# EasyEDA Pro project ProPrj_WLED ESP32 d1 mini shield_2025-11-08.epro

# Schematic Schematic1
Board Name: Board1; Create Date: 2025-10-29; Page Name: P1; Project Name: WLED ESP32 d1 mini shield; Schematic Name: Schematic1; Update Date: 2025-10-31; Company: EasyEDA.com; Page Size: A4; Version: V1.0
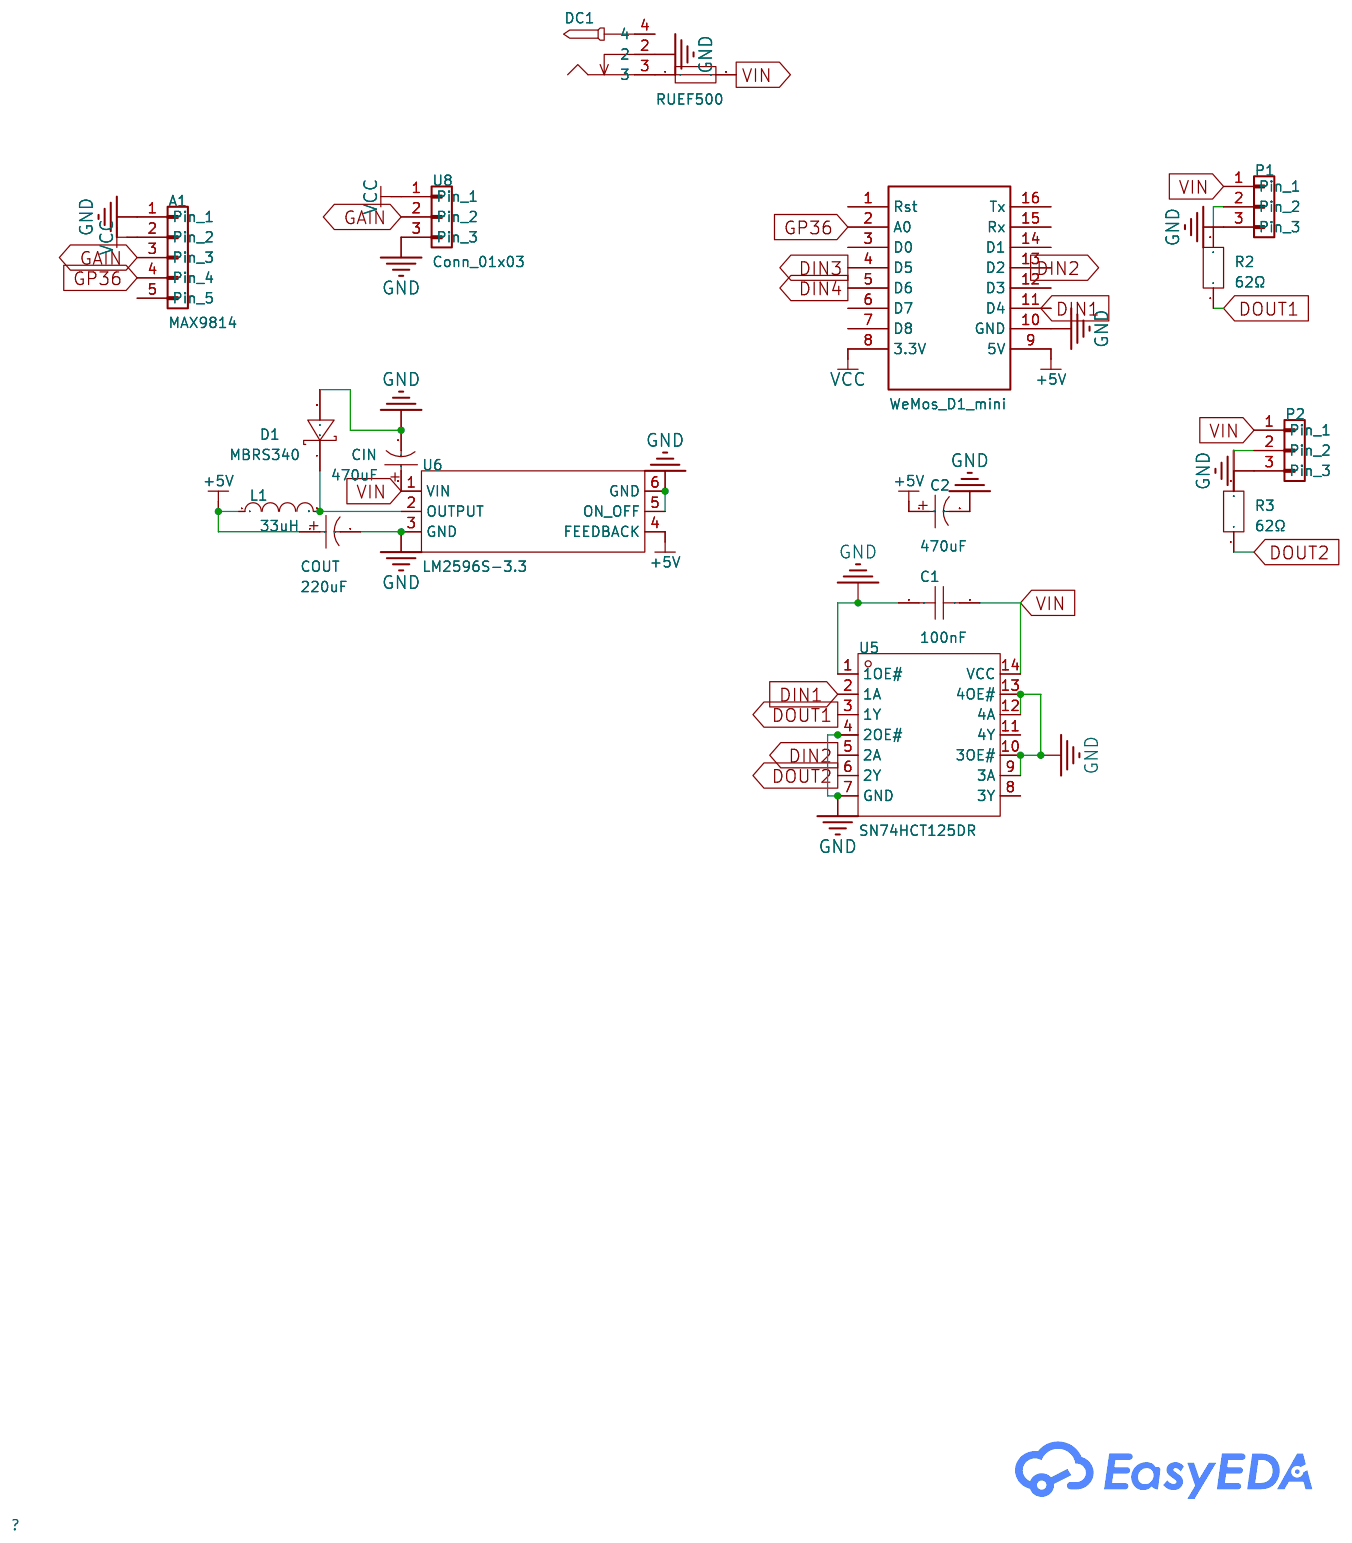
[diagram p0: schematic sheet]

## Parts
A1  MAX9814  [CONN-TH-5P_A2543WV-5P]
C1  100nF  [CAP-TH_L5.8-W2.8]
C2  470uF  [CAP-TH_BD8.0-P3.50-D0.6-FD]
CIN  470uF  [CAP-SMD_L7.3-W4.3_H2.8]
COUT  220uF  [CAP-SMD_L7.3-W4.3_H2.8]
D1  MBRS340  [SMC_L6.9-W5.9-LS7.9-RD]
DC1  DC-005 2.0  [DC-IN-TH_DC-005-5.5-2.0]
F1  RUEF500  [FUSE-TH_L14.0-W3.0-P10.20-D1.2-S1.2]
L1  10uH  [CONN-TH_2P-P2.50_691347000002B]
P1  Conn_01x03  [CONN-TH_3P-P2.54_76384-303LF]
P2  Conn_01x03  [CONN-TH_3P-P2.54_76384-303LF]
R2  62Ω  [R1206]
R3  62Ω  [R1206]
U5  SN74HCT125DR  [SOIC-14_L8.7-W3.9-P1.27-LS6.0-BL]
U6  LM2596S-3.3  [TO-263-5_L10.1-W8.7-P1.70-LS14.4-BR]
U7  WeMos_D1_mini  [wemos-d1-mini-with-pin-header-and-connector]
U8  Conn_01x03  [CONN-TH-3P_A2547WR-3P]

## Library data of the parts
A1 = Conn_01x05
C1 = CC1H104MC1FD3F6C10SA: Capacitance:100nF Tolerance:±20% Tolerance:±20% Voltage Rating:50V Pin Spacing:5.08mm Temperature Coefficient:Y5V Diameter:5.8mm Body Thickness:2.4mm; LCSC Part Name: 100nF ±20% 50V; Supplier Part: C5375966; Manufacturer: Dersonic(德尔创); Supplier Footprint: 插件,P=5.08mm; JLCPCB Part Class: Extended Part; Datasheet: https://item.szlcsc.com/datasheet/CC1H104MC1FD3F6C10SA/6236644.html; Supplier: LCSC; Tolerance: ±20%; Voltage Rating: 50V; Pin Spacing: 5.08mm; Temperature Coefficient: Y5V; Diameter: 5.8mm; Body Thickness: 2.4mm
C2 = KM477M016F12RR0VH2FP0: Capacitance:470uF Tolerance:±20% Tolerance:±20% Voltage Rating:16V Pin Spacing:3.5mm Diameter:8mm Height - Seated (Max):12mm Lifetime:2000hrs@105℃; LCSC Part Name: 470uF ±20% 16V; Supplier Part: C28067; Manufacturer: Chengx(承兴); Supplier Footprint: 插件,D8xL12mm; JLCPCB Part Class: Extended Part; Datasheet: https://item.szlcsc.com/datasheet/KM477M016F12RR0VH2FP0/28817.html; Supplier: LCSC; Tolerance: ±20%; Voltage Rating: 16V; Pin Spacing: 3.5mm; Diameter: 8mm; Height - Seated (Max): 12mm; Lifetime: 2000hrs@105℃
CIN COUT = KM471M025F115A: Capacitance:470uF Tolerance:±20% Tolerance:±20% Voltage Rating:25V Pin Spacing:3.5mm Diameter:8mm Height - Seated (Max):11.5mm Lifetime:2000hrs@105℃; LCSC Part Name: 470uF ±20% 25V; Supplier Part: C59417; Manufacturer: CapXon(丰宾); Supplier Footprint: 插件,D8xL11.5mm; JLCPCB Part Class: Extended Part; Datasheet: https://item.szlcsc.com/datasheet/KM471M025F115A/60470.html; Supplier: LCSC; Tolerance: ±20%; Voltage Rating: 25V; Pin Spacing: 3.5mm; Diameter: 8mm; Height - Seated (Max): 11.5mm; Lifetime: 2000hrs@105℃
D1 = MBRS340: Forward Voltage (Vf@If):525mV@3A Reverse Voltage (Vr):40V Rectified Current:3A; LCSC Part Name: 电压:40V 电流:3A; Supplier Part: C117937; Manufacturer: onsemi(安森美); Supplier Footprint: SMC(DO-214AB); JLCPCB Part Class: Extended Part; Datasheet: https://atta.szlcsc.com/upload/public/pdf/source/20190925/C117937_D31D7D03573F194A3BCE1E17A361CBAF.pdf; Supplier: LCSC; Forward Voltage (Vf@If): 525mV@3A; Reverse Voltage (Vr): 40V; Rectified Current: 3A
DC1 = DC-005 2.0: Connector Type:DC Power Jack Mounting Type:Right Angle Inside Contact Diameter:2mm Outside Contact Diameter:6.4mm Current Rating:1A Voltage Rating (Max):12V Operating Temperature:-25℃~+85℃ Operating Temperature:-25℃~+85℃; LCSC Part Name: DC电源插座 内径:2mm 外径:6.4mm; Supplier Part: C16214; Manufacturer: BOOMELE(博穆精密); Supplier Footprint: 插件; JLCPCB Part Class: Extended Part; Datasheet: https://item.szlcsc.com/datasheet/DC-005%25202.0/16896.html; Supplier: LCSC; Connector Type: DC Power Jack; Mounting Type: Right Angle; Inside Contact Diameter: 2mm; Outside Contact Diameter: 6.4mm; Current Rating: 1A; Voltage Rating (Max): 12V; Operating Temperature: -25℃~+85℃
F1 = RUEF500: Operating Voltage (Max):30V Current Rating (Max):100A Hold Current:5A Trip Current:10A Resistance - Initial (Ri) (Min):10mΩ Maximum Time to Trip:14.5s Operating Temperature:-40℃~+85℃ Operating Temperature:-40℃~+85℃; Supplier Part: C5373322; Manufacturer: Littelfuse(美国力特); JLCPCB Part Class: Extended Part; Datasheet: https://atta.szlcsc.com/upload/public/pdf/source/20230317/F9D2569F74156872D3162B7F6025F5D3.pdf; Supplier: LCSC; Operating Voltage (Max): 30V; Current Rating (Max): 100A; Hold Current: 5A; Trip Current: 10A; Resistance - Initial (Ri) (Min): 10mΩ; Maximum Time to Trip: 14.5s; Operating Temperature: -40℃~+85℃
L1 = L_0603: Supplier Footprint: L0603
P1 P2 U8 = Conn_01x03
R2 R3 = FRC1206J620 TS: Type:Thick Film Resistor Resistance:62Ω Tolerance:±5% Tolerance:±5% Power(Watts):250mW Voltage-Supply(Max):200V Temperature Coefficient:±100ppm/℃ Temperature Coefficient:±100ppm/℃ Operating Temperature:-55℃~+155℃ Operating Temperature:-55℃~+155℃; LCSC Part Name: 62Ω ±5% 250mW 厚膜电阻; Supplier Part: C3013271; Manufacturer: FOJAN(富捷); Supplier Footprint: 1206; JLCPCB Part Class: Extended Part; Supplier: LCSC; Type: Thick Film Resistor; Tolerance: ±5%; Power(Watts): 250mW; Voltage-Supply(Max): 200V; Temperature Coefficient: ±100ppm/℃; Operating Temperature: -55℃~+155℃
U5 = SN74HCT125DR: output type:Tri-State Supply Voltage:4.5V~5.5V Supply Voltage:4.5V~5.5V Number of Elements:4 Number of Bits per Element:1 Sink Current:6mA Source Current:6mA Logic Family:74HCT Operating Temperature:-40℃~+85℃ Operating Temperature:-40℃~+85℃; LCSC Part Name: IC BUF NON-INVERT 5.5V; Supplier Part: C352957; Manufacturer: TI(德州仪器); Supplier Footprint: SOIC-14; JLCPCB Part Class: Extended Part; Datasheet: https://www.ti.com/cn/lit/gpn/sn74hct125; Supplier: LCSC; output type: Tri-State; Supply Voltage: 4.5V~5.5V; Number of Elements: 4; Number of Bits per Element: 1; Sink Current: 6mA; Source Current: 6mA; Logic Family: 74HCT; Operating Temperature: -40℃~+85℃
U6 = LM2596S-3.3_C19632450: Function:Step-down type Output Type:Fixed Voltage - Supply:4.5V~30V Voltage - Supply:4.5V~30V Output Voltage:3.3V Output Voltage:3.3V Output Current:3A Frequency - Switching:150kHz Frequency - Switching:150kHz Operating Temperature:-40℃~+125℃@(TJ) Operati; LCSC Part Name: 3A 150KHz 固定频率 PWM DC-DC 稳压电源转换器; Supplier Part: C19632450; Manufacturer: Slkor(萨科微); Supplier Footprint: TO-263-5; JLCPCB Part Class: Extended Part; Datasheet: https://atta.szlcsc.com/upload/public/pdf/source/20240712/7CEC394F596FC009EDCB3D077A01D249.pdf; Supplier: LCSC; Function: Step-down type; Output Type: Fixed; Voltage - Supply: 4.5V~30V; Output Voltage: 3.3V; Output Current: 3A; Frequency - Switching: 150kHz; Operating Temperature: -40℃~+125℃@(TJ); Synchronous Rectifier: No; Number of Outputs: 1; Topology: Step-down; Switch tube (built-in/external): Built-in
U7 = WeMos_D1_mini

## Nets
+5V: C2.1 COUT.1 L1.1 U6.4(FEEDBACK) U7.9(5V)
GND: A1.1(Pin) C1.1 C2.2 CIN.2 COUT.2 D1.2(A) DC1.2 P1.3(Pin) P2.3(Pin) U5.1(1OE#) U5.4(2OE#) U5.7(GND) U5.9(3A) U5.10(3OE#) U5.12(4A) U5.13(4OE#) U6.3(GND) U6.5(ON_OFF) U6.6(GND) U7.10(GND) U8.3(Pin)
VCC: A1.2(Pin) U7.8(3.3V) U8.1(Pin)
VIN: C1.2 CIN.1 F1.2 P1.1(Pin) P2.1(Pin) U5.14(VCC) U6.1(VIN)
DIN1: U5.2(1A) U7.11(D4)
DIN2: U5.5(2A) U7.13(D2)
DIN3: U7.4(D5)
DIN4: U7.5(D6)
DOUT1: R2.1 U5.3(1Y)
DOUT2: R3.1 U5.6(2Y)
GAIN: A1.3(Pin) U8.2(Pin)
GP36: A1.4(Pin) U7.2(A0)
$1N1712: P1.2(Pin) R2.2
$1N2427: P2.2(Pin) R3.2
$1N4421: D1.1(C) L1.2 U6.2(OUTPUT)
$1N6334: DC1.3 F1.1

Not connected (* = marked no-connect by the designer): A1 5(Pin); DC1 4; U5 8(3Y) 11(4Y); U7 1(Rst) 3(D0) 6(D7) 7(D8) 12(D3) 14(D1) 15(Rx) 16(Tx)

# Board PCB1
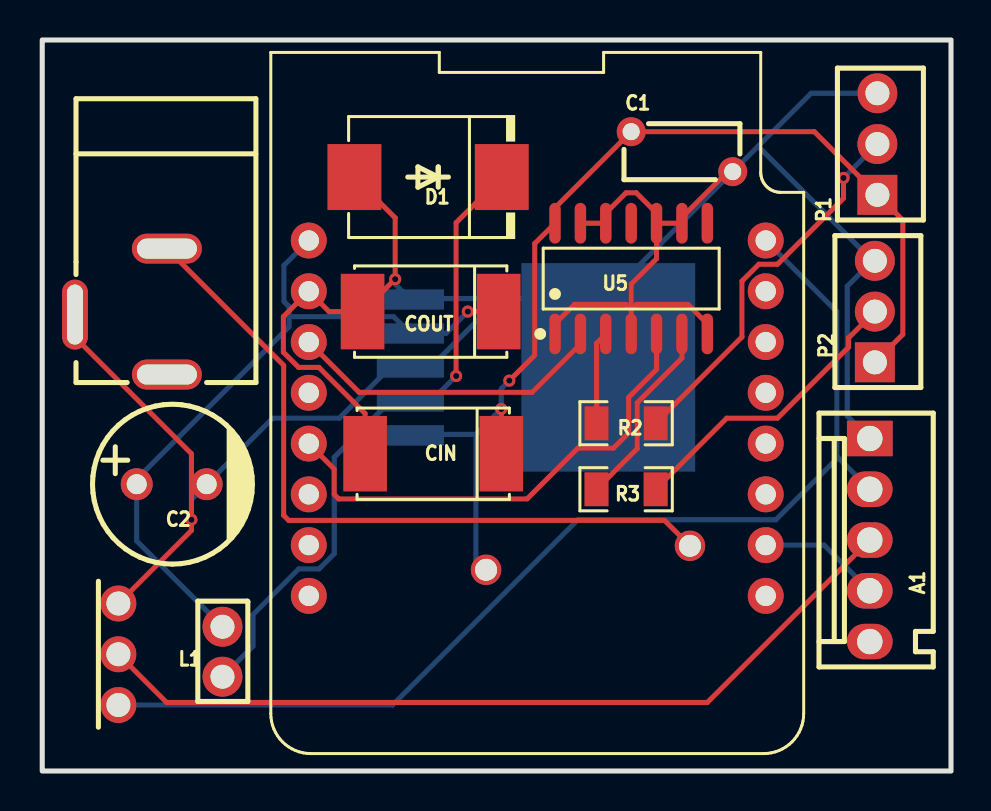
[diagram p1: board, top side]
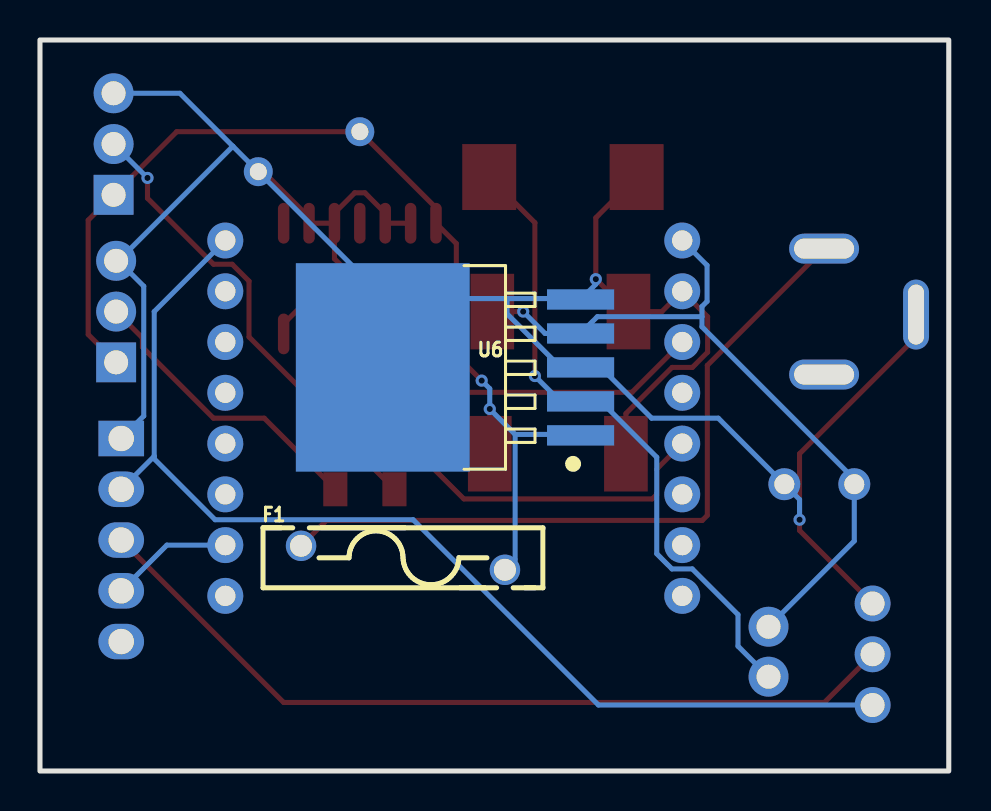
[diagram p2: board, bottom side, seen from below]

Outline 45.47 x 36.58 mm; copper layers: Top Layer, Bottom Layer. Coordinates in mm from the lower left corner of the outline.
Outline path: rectangle 0,36.58 45.47,0
Stack: Top Layer 0.035mm / Dielectric1 1.51mm FR4 er 4.5 / Bottom Layer 0.035mm

## Design rules (mm)
template: JLCPCB Capability(Two Layers Board)
spacing copperThickness1oz (default): track to track 0.102, other pairs 0.152 to 0.3
spacing copperThickness2oz: track to track 0.203, other pairs 0.152 to 0.3
track width copperThickness1oz (default): min 0.127, default 0.254, max 2.54
track width copperThickness2oz: min 0.203, default 0.254, max 2.54
differential pair differentialPair (default): width min 0.127, default 0.254, max 2.54; gap min 0.152, default 0.152
via viaSize (default): diameter min 0.5, default 0.61, max 10; hole min 0.3, default 0.305, max 6.3

## Placement (name value [footprint] x y rotation side)
A1  MAX9814  [CONN-TH-5P_A2543WV-5P]  41.4 11.56 90 top
C1  100nF  [CAP-TH_L5.8-W2.8]  32 30.99 180 top
C2  470uF  [CAP-TH_BD8.0-P3.50-D0.6-FD]  6.48 14.35 0 top
CIN  470uF  [CAP-SMD_L7.3-W4.3_H2.8]  19.56 15.88 0 top
COUT  220uF  [CAP-SMD_L7.3-W4.3_H2.8]  19.43 22.99 0 top
D1  MBRS340  [SMC_L6.9-W5.9-LS7.9-RD]  19.3 29.72 180 top
DC1  DC-005 2.0  [DC-IN-TH_DC-005-5.5-2.0]  3.94 22.99 270 top
F1  RUEF500  [FUSE-TH_L14.0-W3.0-P10.20-D1.2-S1.2]  27.3 10.67 180 bottom
L1  10uH  [CONN-TH_2P-P2.50_691347000002B]  9.02 5.97 270 top
P1  Conn_01x03  [CONN-TH_3P-P2.54_76384-303LF]  41.78 31.37 90 top
P2  Conn_01x03  [CONN-TH_3P-P2.54_76384-303LF]  41.66 22.99 90 top
R2  62Ω  [R1206]  29.21 17.4 0 top
R3  62Ω  [R1206]  29.21 14.1 0 top
U5  SN74HCT125DR  [SOIC-14_L8.7-W3.9-P1.27-LS6.0-BL]  29.46 24.64 0 top
U6  LM2596S-3.3  [TO-263-5_L10.1-W8.7-P1.70-LS14.4-BR]  23.37 20.19 180 bottom
U7  WeMos_D1_mini  [wemos-d1-mini-with-pin-header-and-connector]  24.77 17.65 270 top
U8  Conn_01x03  [CONN-TH-3P_A2547WR-3P]  3.81 5.84 90 top

## Footprints (pads in the part's own frame, mm; a bottom-side part is the same pattern mirrored in y, then rotated)
CAP-SMD_L7.3-W4.3_H2.8
  rect 2.185x3.78 smd: 1(3.406,0) 2(-3.406,0)
CAP-TH_BD8.0-P3.50-D0.6-FD
  round 1.6 hole 1: 1(-1.75,0) 2(1.75,0)
CAP-TH_L5.8-W2.8
  round 1.45 hole 0.85: 1(-2.54,1) 2(2.54,-1)
CONN-TH-3P_A2547WR-3P
  round 1.8 hole 1.2: 1(-2.54,0) 2(0,0) 3(2.54,0)
CONN-TH-5P_A2543WV-5P
  rect 1.778x2.286 hole 1.27: 1(5.08,0)
  oval 1.778x2.286 hole 1.27: 2(2.54,0) 3(0,0) 4(-2.54,0) 5(-5.08,0)
CONN-TH_2P-P2.50_691347000002B
  round 2 hole 1.2: 1(-1.25,0) 2(1.25,0)
CONN-TH_3P-P2.54_76384-303LF
  rect 2x2 hole 1.2: 1(-2.54,0)
  round 2 hole 1.2: 2(0,0) 3(2.54,0)
DC-IN-TH_DC-005-5.5-2.0
  oval 3.5x1.3 hole 3x0.8: 2(0.15,-2.3)
  oval 1.5x3.5 hole 1x3: 3(-3.15,2.3) 4(3.15,2.3)
FUSE-TH_L14.0-W3.0-P10.20-D1.2-S1.2
  round 1.524 hole 1.1: 1(-5.1,0.6) 2(5.1,-0.6)
R1206
  rect 1.208x1.701 smd: 1(-1.479,0) 2(1.479,0)
SMC_L6.9-W5.9-LS7.9-RD
  rect 2.7x3.3 smd: 1(-3.687,0) 2(3.687,0)
SOIC-14_L8.7-W3.9-P1.27-LS6.0-BL
  oval 0.574x2.038 smd: 1(-3.81,-2.769) 2(-2.54,-2.769) 3(-1.27,-2.769) 4(0,-2.769) 5(1.27,-2.769) 6(2.54,-2.769) 7(3.81,-2.769) 8(3.81,2.769) 9(2.54,2.769) 10(1.27,2.769) 11(0,2.769) 12(-1.27,2.769) 13(-2.54,2.769) 14(-3.81,2.769)
TO-263-5_L10.1-W8.7-P1.70-LS14.4-BR
  rect 3.358x1.02 smd: 1(4.949,-3.4) 2(4.949,-1.7) 3(4.949,0) 4(4.949,1.7) 5(4.949,3.4)
  rect 8.7x10.431 smd: 6(-4.949,0)
wemos-d1-mini-with-pin-header-and-connector
  round 1.8 hole 1.016: 1(8.89,11.43) 2(6.35,11.43) 3(3.81,11.43) 4(1.27,11.43) 5(-1.27,11.43) 6(-3.81,11.43) 7(-6.35,11.43) 8(-8.89,11.43) 9(-8.89,-11.43) 10(-6.35,-11.43) 11(-3.81,-11.43) 12(-1.27,-11.43) 13(1.27,-11.43) 14(3.81,-11.43) 15(6.35,-11.43) 16(8.89,-11.43)

## Nets
As in the schematic.

Pads without a net: A1 5; DC1 4; U5 8 11; U7 1 3 6 7 12 14 15 16

## Via types
v1: diameter 0.61, hole 0.305, Top Layer to Bottom Layer, 7 vias

## Routing (per net, layer and track width the routed paths; a pad name or vN(x,y) marks a point on that pad's centre or on a via; arc(x,y) is an arc through that point)
+5V: length 36.2
  Top Layer w0.254: v1(21.29,22.99) COUT.1
  Bottom Layer w0.254: L1.1 4.73,11.51 C2.1 4.73,14.61 12.35,22.23 12.35,22.73 ; 12.35,22.73 17.58,22.73 U6.4 20.2,21.89 v1(21.29,22.99) ; 12.35,22.73 12.35,23.24 12.09,23.5 12.09,25.3 U7.9
GND: length 138.1
  Top Layer w0.254: CIN.2 16.15,17.88 13.84,20.19 12.83,20.19 12.07,20.95 12.07,22.73 U7.10 14.35,22.99 COUT.2 17.65,24.61 v1(17.66,24.61) 17.66,27.68 D1.2 ; 29.46,23.09 29.72,23.34 32.31,23.34 33.27,22.38 33.27,21.87 ; 29.46,23.09 29.46,24.36 30.73,25.63 30.73,27.41 ; 29.46,23.09 U5.4 ; 29.46,23.09 29.21,23.34 26.62,23.34 25.65,22.38 U5.1 ; U8.3 7.46,12.04 v1(7.46,12.57) 7.46,15.88 1.64,21.7 DC1.2 ; 30.73,27.41 30.73,27.92 29.72,28.93 29.21,28.93 28.19,27.92 U5.12 U5.13 ; 30.73,27.41 U5.9 32,27.7 34.29,29.99 C1.1
  Bottom Layer w0.254: 35.81,31.26 41.55,25.53 ; 35.81,31.26 C1.1 28.45,23.89 28.45,23.64 ; 35.81,31.26 38.46,33.91 P1.3 ; 41.55,25.53 P2.3 ; 41.55,25.53 40.27,24.26 40.27,17.76 A1.1 ; 28.45,23.64 22.1,23.64 ; 28.45,23.64 28.45,20.32 U6.6 ; 22.1,23.64 18.46,23.64 U6.5 17.66,24.36 v1(17.66,24.61) ; 22.1,23.64 22.1,22.88 19.42,20.19 U6.3 17.4,20.19 14.86,17.65 11.53,17.65 C2.2 7.46,13.59 v1(7.46,12.57)
VCC: length 55.8
  Bottom Layer w0.254: U7.8 39.75,22.99 39.75,15.75 ; 3.81,3.3 17.53,3.3 26.8,12.57 36.7,12.57 39.75,15.62 39.75,15.75 ; 39.75,15.75 A1.2
VIN: length 54
  Top Layer w0.254: P2.1 43.05,21.84 43.05,27.56 P1.1 38.62,31.99 C1.2 25.65,28.18 U5.14 24.64,26.39 24.64,20.8 v1(23.37,19.53) ; v1(22.96,18.11) CIN.1
  Bottom Layer w0.254: U6.1 18.47,16.84 21.69,16.84 ; 21.69,16.84 v1(22.96,18.11) 22.96,19.13 v1(23.37,19.53) ; 21.69,16.84 21.69,10.58 22.2,10.07
DIN1: length 16.1
  Top Layer w0.254: U7.11 15.85,18.95 24.51,18.95 26.92,21.36 U5.2
DIN2: length 24.8
  Top Layer w0.254: 30.73,21.87 30.73,20.09 29.34,18.69 29.34,16.92 28.58,16.15 26.8,16.15 24.26,13.61 14.83,13.61 14.61,13.84 14.61,15.11 U7.13
DOUT1: length 4.7
  Top Layer w0.254: U5.3 27.73,21.41 R2.1
DOUT2: length 9.5
  Top Layer w0.254: U5.6 32,20.66 29.76,18.42 29.76,16.13 R3.1
GAIN: length 42
  Top Layer w0.254: U8.2 6.22,3.43 33.27,3.43 A1.3
GP36: length 6.2
  Bottom Layer w0.254: U7.2 39.12,11.3 A1.4
$1N1712: length 19.1
  Top Layer w0.254: R2.2 35.01,21.72 35.01,24.51 35.85,25.36 36.79,25.36 40.09,28.66 v1(40.09,29.67)
  Bottom Layer w0.254: v1(40.09,29.67) P1.2
$1N2427: length 14.9
  Top Layer w0.254: R3.2 34.24,17.65 36.79,17.65 40.34,21.21 40.34,21.67 P2.2
$1N4421: length 32.6
  Top Layer w0.254: D1.1 20.71,27.43 v1(20.71,19.76)
  Bottom Layer w0.254: v1(20.71,19.76) 19.44,18.49 U6.2 17.4,18.49 14.61,15.7 14.61,10.87 13.85,10.11 12.83,10.11 10.55,7.83 10.55,6.25 L1.2
$1N6334: length 36.7
  Top Layer w0.254: DC1.3 12.08,20.3 12.08,12.79 12.33,12.54 31.14,12.54 F1.1
